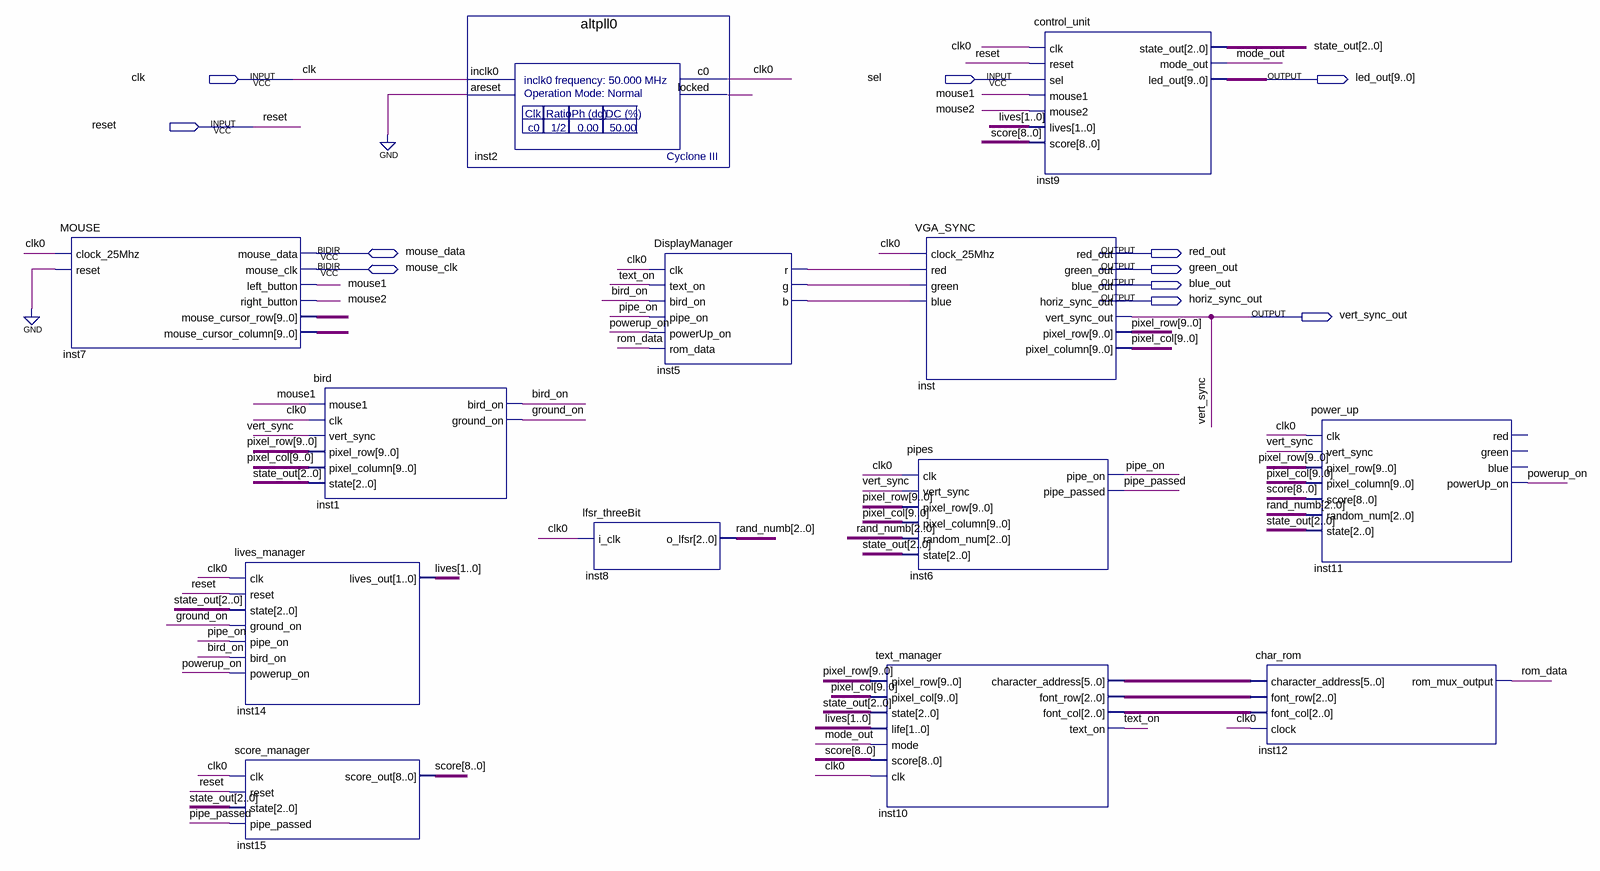
[diagram p0: schematic sheet]
// Quartus schematic FlipFlopBird.bdf as structural Verilog: 13 symbols, 11 pins
module FlipFlopBird (
  input  clk,
  input  sel,
  input  reset,
  inout  mouse_data,
  inout  mouse_clk,
  output [9:0] led_out,
  output red_out,
  output green_out,
  output blue_out,
  output horiz_sync_out,
  output vert_sync_out
);

  wire bird_on, clk0, ground_on, inst2_locked, inst5_b, inst5_g, inst5_r, mode_out, mouse1, mouse2, pipe_on,
       pipe_passed, powerup_on, rom_data, text_on;
  wire [1:0] lives;
  wire [2:0] inst10_font_col, inst10_font_row, rand_numb, state_out;
  wire [5:0] inst10_character_address;
  wire [8:0] score;
  wire [9:0] inst7_mouse_cursor_column, inst7_mouse_cursor_row, pixel_col, pixel_row;

  MOUSE inst7 (
    .clock_25Mhz(clk0), .reset(1'b0), .left_button(mouse1), .right_button(mouse2),
    .mouse_cursor_row(inst7_mouse_cursor_row), .mouse_cursor_column(inst7_mouse_cursor_column),
    .mouse_data(mouse_data), .mouse_clk(mouse_clk));
  lives_manager inst14 (
    .clk(clk0), .reset(reset), .state(state_out), .ground_on(ground_on), .pipe_on(pipe_on),
    .bird_on(bird_on), .powerup_on(powerup_on), .lives_out(lives));
  score_manager inst15 (.clk(clk0), .reset(reset), .state(state_out), .pipe_passed(pipe_passed), .score_out(score));
  bird inst1 (
    .mouse1(mouse1), .clk(clk0), .vert_sync(vert_sync_out), .pixel_row(pixel_row), .pixel_column(pixel_col),
    .state(state_out), .bird_on(bird_on), .ground_on(ground_on));
  altpll0 inst2 (.inclk0(clk), .areset(1'b0), .c0(clk0), .locked(inst2_locked));
  lfsr_threeBit inst8 (.i_clk(clk0), .o_lfsr(rand_numb));
  DisplayManager inst5 (
    .clk(clk0), .text_on(text_on), .bird_on(bird_on), .pipe_on(pipe_on), .powerUp_on(powerup_on),
    .rom_data(rom_data), .r(inst5_r), .g(inst5_g), .b(inst5_b));
  text_manager inst10 (
    .pixel_row(pixel_row), .pixel_col(pixel_col), .state(state_out), .life(lives), .mode(mode_out),
    .score(score), .clk(clk0), .character_address(inst10_character_address), .font_row(inst10_font_row),
    .font_col(inst10_font_col), .text_on(text_on));
  VGA_SYNC inst (
    .clock_25Mhz(clk0), .red(inst5_r), .green(inst5_g), .blue(inst5_b), .red_out(red_out),
    .green_out(green_out), .blue_out(blue_out), .horiz_sync_out(horiz_sync_out),
    .vert_sync_out(vert_sync_out), .pixel_row(pixel_row), .pixel_column(pixel_col));
  pipes inst6 (
    .clk(clk0), .vert_sync(vert_sync_out), .pixel_row(pixel_row), .pixel_column(pixel_col),
    .random_num(rand_numb), .state(state_out), .pipe_on(pipe_on), .pipe_passed(pipe_passed));
  control_unit inst9 (
    .clk(clk0), .reset(reset), .sel(sel), .mouse1(mouse1), .mouse2(mouse2), .lives(lives), .score(score),
    .state_out(state_out), .mode_out(mode_out), .led_out(led_out));
  char_rom inst12 (
    .character_address(inst10_character_address), .font_row(inst10_font_row), .font_col(inst10_font_col),
    .clock(clk0), .rom_mux_output(rom_data));
  power_up inst11 (
    .clk(clk0), .vert_sync(vert_sync_out), .pixel_row(pixel_row), .pixel_column(pixel_col), .score(score),
    .random_num(rand_numb), .state(state_out), .powerUp_on(powerup_on));  // open: red, green, blue

  // Other names for the same wires on the sheet: vert_sync = vert_sync_out
endmodule
